# Altium schematic sheet datage_drv_tb_bs.SchDoc
size A4
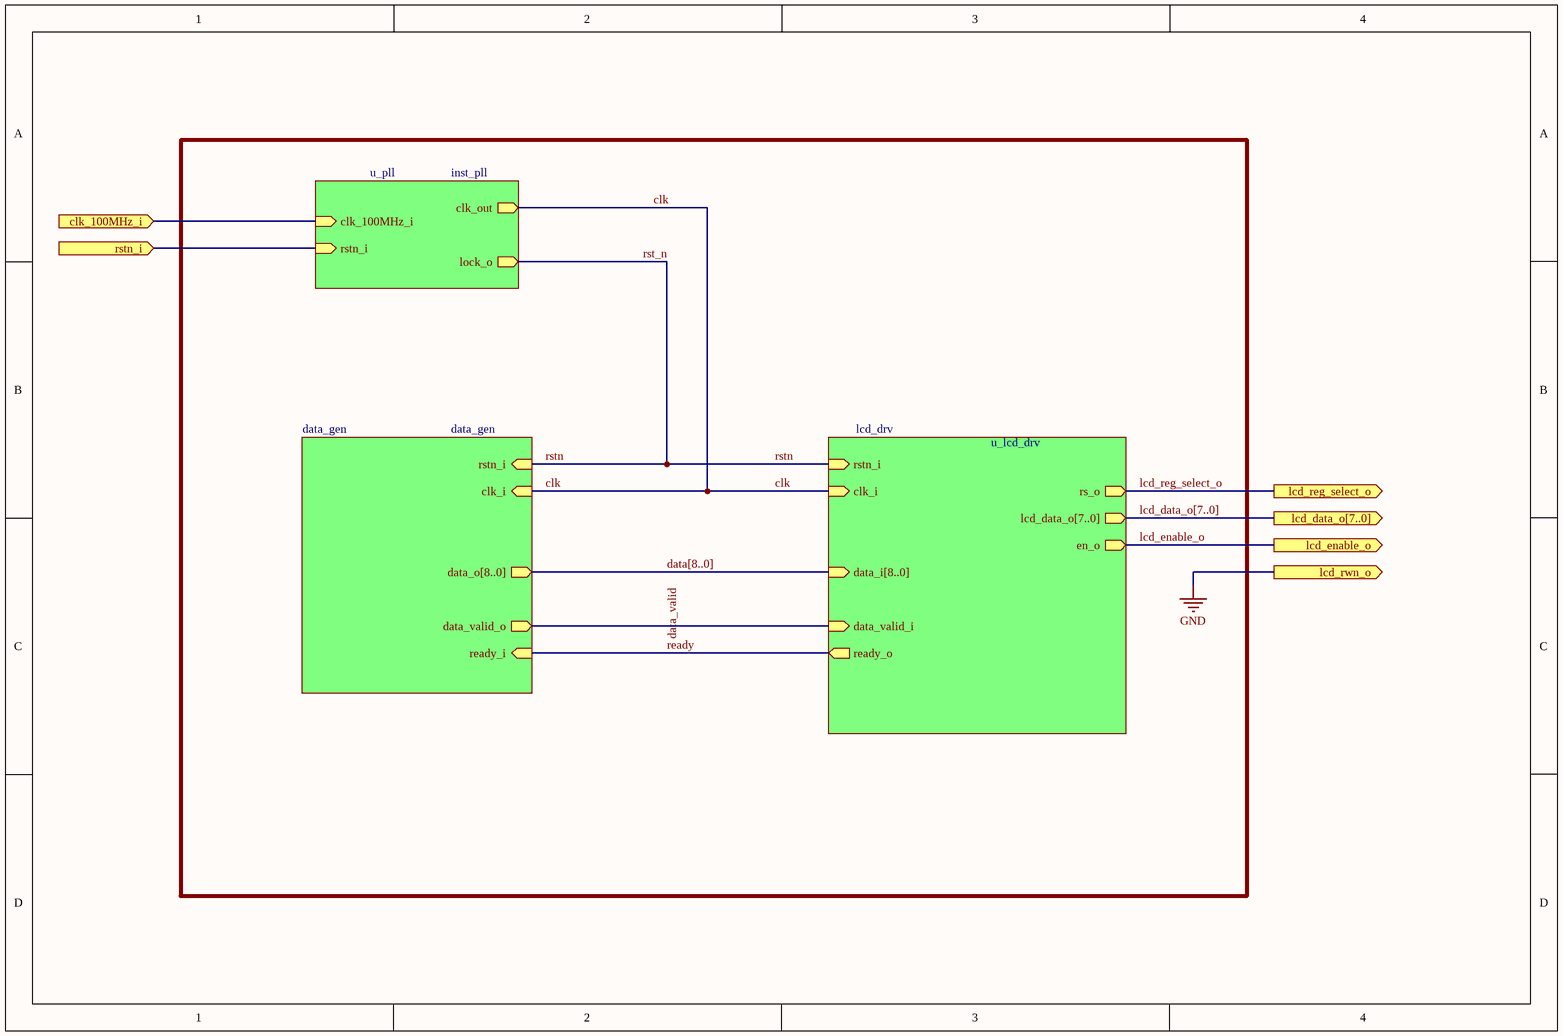
[diagram p0: datage_drv_tb_bs.SchDoc]

## Sub-sheets
data_gen = data_gen: data_o[8..0] (out), data_valid_o (out), ready_i (in), clk_i (in), rstn_i (in)
lcd_drv = u_lcd_drv: rs_o (out), lcd_data_o[7..0] (out), en_o (out), clk_i (in), data_i[8..0] (in), data_valid_i (in), ready_o (out), rstn_i (in)
u_pll = inst_pll: clk_out (out), lock_o (out), clk_100MHz_i (in), rstn_i (in)

## Ports
clk_100MHz_i (in), lcd_data_o[7..0] (out), lcd_enable_o (out), lcd_reg_select_o (out), lcd_rwn_o (out), rstn_i (in)

## Nets
GND: port lcd_rwn_o
clk: sheet lcd_drv/clk_i, sheet data_gen/clk_i, sheet u_pll/clk_out
clk_100MHz_i: port clk_100MHz_i, sheet u_pll/clk_100MHz_i
lcd_enable_o: port lcd_enable_o, sheet lcd_drv/en_o
lcd_reg_select_o: port lcd_reg_select_o, sheet lcd_drv/rs_o
ready: sheet lcd_drv/ready_o, sheet data_gen/ready_i
rst_n: sheet lcd_drv/rstn_i, sheet data_gen/rstn_i, sheet u_pll/lock_o  [also labelled rstn]
rstn_i: port rstn_i, sheet u_pll/rstn_i
(unnamed): sheet lcd_drv/data_valid_i, sheet data_gen/data_valid_o

## Buses and harness runs
bus data[8..0] = sheet data_gen/data_o[8..0] = sheet lcd_drv/data_i[8..0]
bus lcd_data_o[7..0] = port lcd_data_o[7..0] = sheet lcd_drv/lcd_data_o[7..0]

## Notes on the sheet
- Labels drawn without touching a wire or pin: data_valid